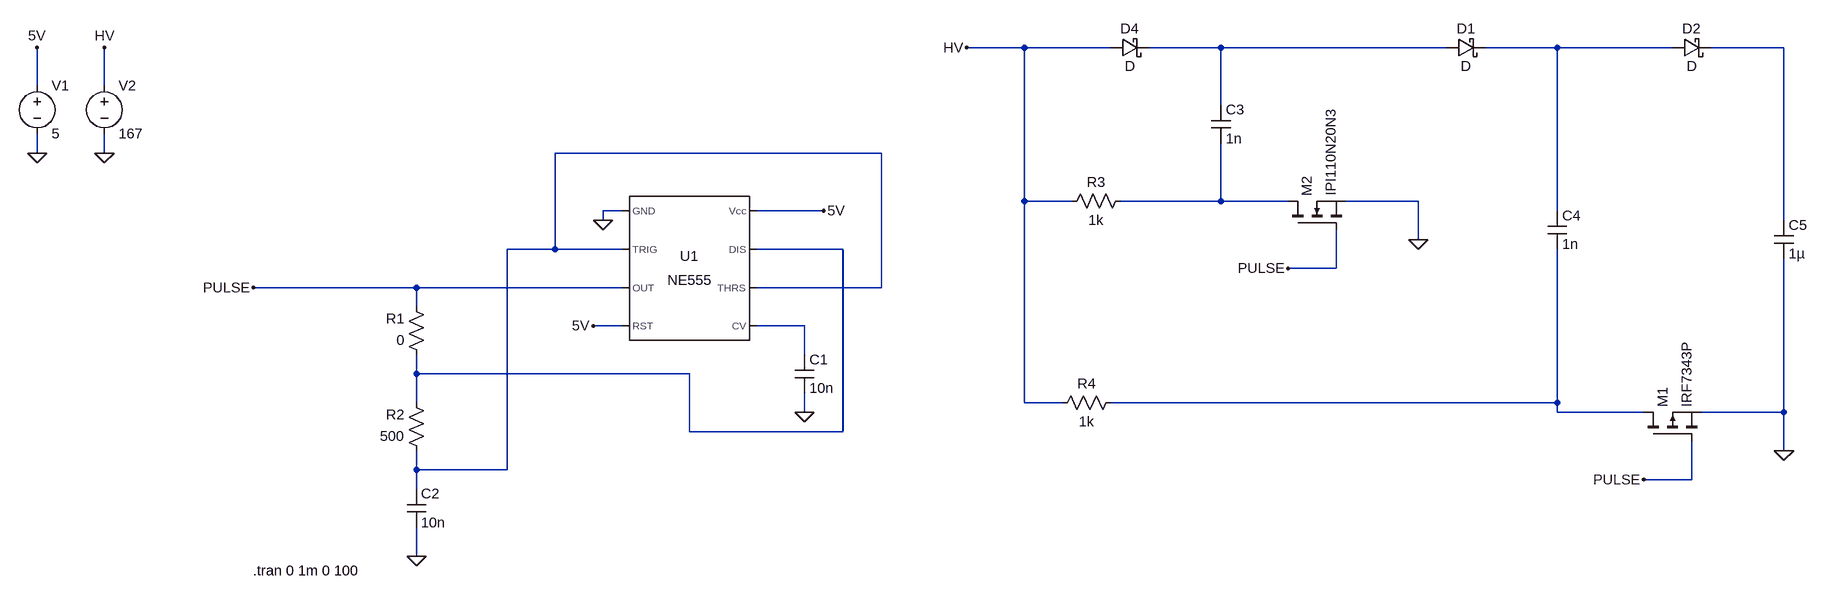
[diagram p0: schematic doubler_555.asc]
doubler_555.asc, the LTspice schematic file:
Version 4
SHEET 1 3216 680
WIRE 928 -208 832 -208
WIRE 1072 -208 928 -208
WIRE 1296 -208 1136 -208
WIRE 1696 -208 1296 -208
WIRE 1920 -208 1760 -208
WIRE 2112 -208 1920 -208
WIRE 2336 -208 2176 -208
WIRE -1456 -144 -1456 -208
WIRE -1344 -144 -1344 -208
WIRE 1296 -112 1296 -208
WIRE -1456 -32 -1456 -64
WIRE -1344 -32 -1344 -64
WIRE 528 -32 -16 -32
WIRE 928 48 928 -208
WIRE 1008 48 928 48
WIRE 1296 48 1296 -48
WIRE 1296 48 1088 48
WIRE 1408 48 1296 48
WIRE 1648 48 1504 48
WIRE 96 64 64 64
WIRE 432 64 320 64
WIRE 1920 64 1920 -208
WIRE 64 80 64 64
WIRE 2336 80 2336 -208
WIRE 1648 112 1648 48
WIRE -16 128 -16 -32
WIRE -16 128 -96 128
WIRE 96 128 -16 128
WIRE 464 128 320 128
WIRE 1488 160 1488 96
WIRE 1488 160 1408 160
WIRE -272 192 -544 192
WIRE 96 192 -272 192
WIRE 528 192 528 -32
WIRE 528 192 320 192
WIRE -272 224 -272 192
WIRE 96 256 48 256
WIRE 400 256 320 256
WIRE 400 304 400 256
WIRE -272 336 -272 304
WIRE 208 336 -272 336
WIRE -272 384 -272 336
WIRE 928 384 928 48
WIRE 992 384 928 384
WIRE 1920 384 1920 128
WIRE 1920 384 1072 384
WIRE 400 400 400 368
WIRE 1920 400 1920 384
WIRE 2064 400 1920 400
WIRE 2336 400 2336 144
WIRE 2336 400 2160 400
WIRE 208 432 208 336
WIRE 464 432 464 128
WIRE 464 432 208 432
WIRE 2336 464 2336 400
WIRE -272 496 -272 464
WIRE -96 496 -96 128
WIRE -96 496 -272 496
WIRE 2144 512 2144 448
WIRE 2144 512 2064 512
WIRE -272 528 -272 496
WIRE -272 640 -272 592
FLAG 64 80 0
FLAG -1456 -32 0
FLAG 400 400 0
FLAG -272 640 0
FLAG -1456 -208 5V
FLAG 432 64 5V
FLAG 48 256 5V
FLAG 1408 160 PULSE
FLAG -1344 -32 0
FLAG -1344 -208 HV
FLAG 832 -208 HV
FLAG 1648 112 0
FLAG 2336 464 0
FLAG 2064 512 PULSE
FLAG -544 192 PULSE
SYMBOL Misc\\NE555 208 160 R0
SYMATTR InstName U1
SYMBOL voltage -1456 -160 R0
WINDOW 123 0 0 Left 0
WINDOW 39 0 0 Left 0
SYMATTR InstName V1
SYMATTR Value 5
SYMBOL cap 384 304 R0
SYMATTR InstName C1
SYMATTR Value 10n
SYMBOL res -256 320 R180
WINDOW 0 36 76 Left 2
WINDOW 3 36 40 Left 2
SYMATTR InstName R1
SYMATTR Value 0
SYMBOL res -256 480 R180
WINDOW 0 36 76 Left 2
WINDOW 3 36 40 Left 2
SYMATTR InstName R2
SYMATTR Value 500
SYMBOL cap -288 528 R0
SYMATTR InstName C2
SYMATTR Value 10n
SYMBOL voltage -1344 -160 R0
WINDOW 123 0 0 Left 0
WINDOW 39 0 0 Left 0
SYMATTR InstName V2
SYMATTR Value 167
SYMBOL nmos 1408 96 R270
SYMATTR InstName M2
SYMATTR Value IPI110N20N3
SYMBOL res 1104 32 R90
WINDOW 0 0 56 VBottom 2
WINDOW 3 32 56 VTop 2
SYMATTR InstName R3
SYMATTR Value 1k
SYMBOL cap 1280 -112 R0
SYMATTR InstName C3
SYMATTR Value 1n
SYMBOL res 1088 368 R90
WINDOW 0 0 56 VBottom 2
WINDOW 3 32 56 VTop 2
SYMATTR InstName R4
SYMATTR Value 1k
SYMBOL cap 1904 64 R0
SYMATTR InstName C4
SYMATTR Value 1n
SYMBOL pmos 2064 448 R270
SYMATTR InstName M1
SYMATTR Value IRF7343P
SYMBOL cap 2320 80 R0
SYMATTR InstName C5
SYMATTR Value 1µ
SYMBOL schottky 1072 -224 M90
WINDOW 0 0 32 VBottom 2
WINDOW 3 32 32 VTop 2
SYMATTR InstName D4
SYMBOL schottky 1696 -224 M90
WINDOW 0 0 32 VBottom 2
WINDOW 3 32 32 VTop 2
SYMATTR InstName D1
SYMBOL schottky 2112 -224 M90
WINDOW 0 0 32 VBottom 2
WINDOW 3 32 32 VTop 2
SYMATTR InstName D2
TEXT -544 664 Left 2 !.tran 0 1m 0 100

The netlist it stands for:
* doubler_555.asc
XU1 0 N004 PULSE 5V N007 N004 N006 5V NE555  ; pins GND TRIG OUT RST CV THRS DIS Vcc
V1 5V 0 5
C1 N007 0 10n
R1 N006 PULSE 0
R2 N004 N006 500
C2 N004 0 10n
V2 HV 0 167
M2 N005 PULSE 0 0 IPI110N20N3
R3 N005 HV 1k
C3 N001 N005 1n
R4 N008 HV 1k
C4 N002 N008 1n
M1 N008 PULSE 0 0 IRF7343P
C5 N003 0 1µ
D4 HV N001 D
D1 N001 N002 D
D2 N002 N003 D
.model D D
.lib standard.dio
.model NMOS NMOS
.model PMOS PMOS
.lib standard.mos
.tran 0 1m 0 100
.lib NE555.sub
.backanno
.end